# EAGLE design OneWire_I2C_8 (EAGLE 7.2.0)
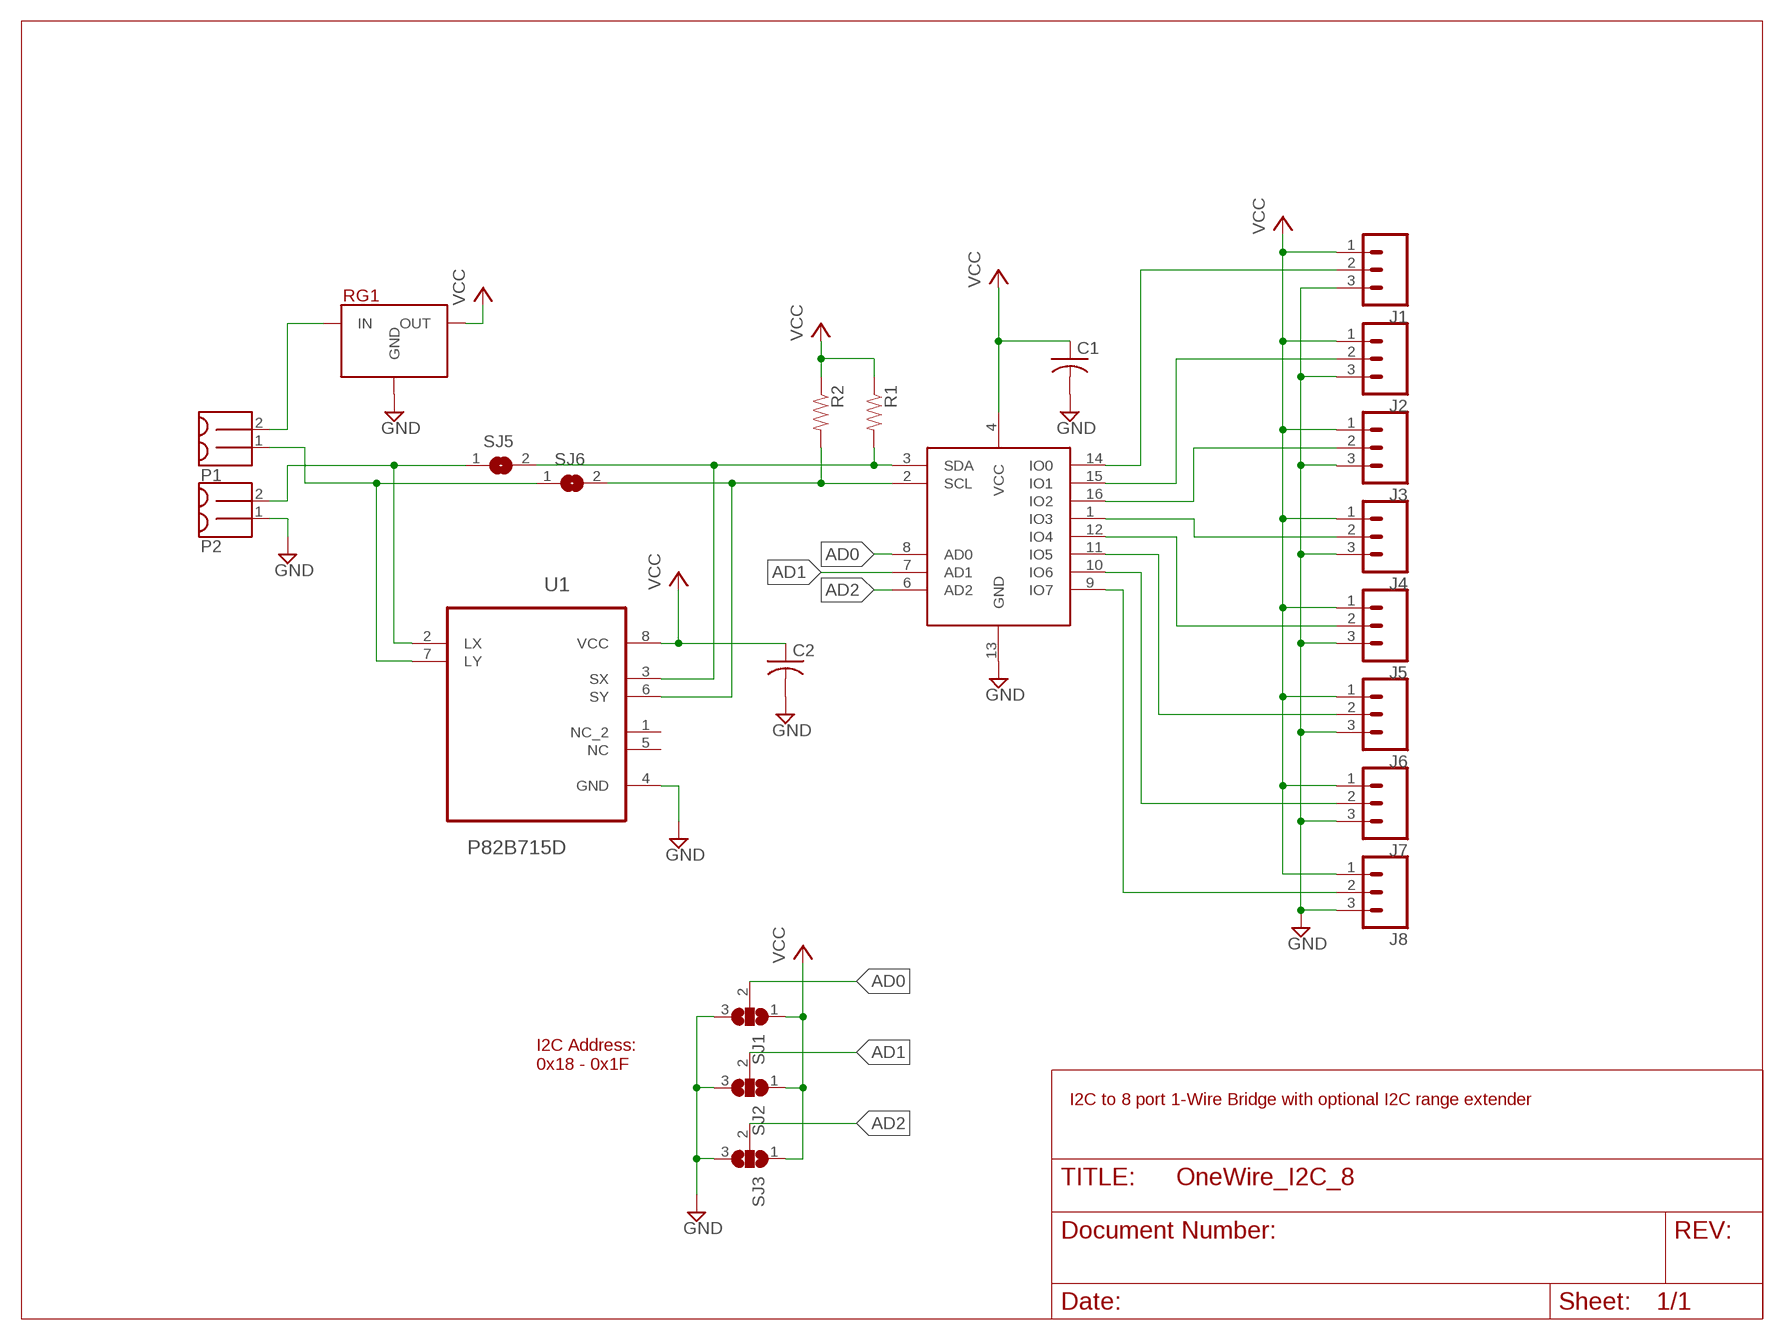
[diagram p0: schematic, sheet 1]

## Parts
C1  C-USC0603  [C0603]
C2  C-USC0603  [C0603]
J1  M03PTH  [1X03]
J2  M03PTH  [1X03]
J3  M03PTH  [1X03]
J4  M03PTH  [1X03]
J5  M03PTH  [1X03]
J6  M03PTH  [1X03]
J7  M03PTH  [1X03]
J8  M03PTH  [1X03]
P1  MOLEX_MINILITE_TRAP_2  [MOLEX_MINILITE_TRAP_2]
P2  MOLEX_MINILITE_TRAP_2  [MOLEX_MINILITE_TRAP_2]
R1  RESISTOR0603-RES  [0603-RES]
R2  RESISTOR0603-RES  [0603-RES]
RG1  MURATA_REG  [MURATA_REG_HOR]
SJ1  SJ2W  [SJ_2]
SJ2  SJ2W  [SJ_2]
SJ3  SJ2W  [SJ_2]
SJ5  SJ  [SJ]
SJ6  SJ  [SJ]
U1  P82B715D  [SOIC127P600X175-8N]
W1  DS2482-800  [SOIC16]

## Nets
AD0: SJ1.2 W1.8(AD0)
AD1: SJ2.2 W1.7(AD1)
AD2: SJ3.2 W1.6(AD2)
GND: C1.2 C2.2 J1.3 J2.3 J3.3 J4.3 J5.3 J6.3 J7.3 J8.3 P2.1 RG1.2(GND) SJ1.3 SJ2.3 SJ3.3 U1.4(GND) W1.13(GND)
IN: P1.2 RG1.1(IN)
IO0: J1.2 W1.14(IO0)
IO1: J2.2 W1.15(IO1)
IO2: J3.2 W1.16(IO2)
IO3: J4.2 W1.1(IO3)
IO4: J5.2 W1.12(IO4)
IO5: J6.2 W1.11(IO5)
IO6: J7.2 W1.10(IO6)
IO7: J8.2 W1.9(IO7)
LY: P1.1 SJ6.1 U1.7(LY)
N$3: P2.2 SJ5.1 U1.2(LX)
SCL: R2.2 SJ6.2 U1.6(SY) W1.2(SCL)
SDA: R1.2 SJ5.2 U1.3(SX) W1.3(SDA)
VCC: C1.1 C2.1 J1.1 J2.1 J3.1 J4.1 J5.1 J6.1 J7.1 J8.1 R1.1 R2.1 RG1.3(OUT) SJ1.1 SJ2.1 SJ3.1 U1.8(VCC) W1.4(VCC)
Unconnected: U1.1(NC_2) U1.5(NC)

## Notes on the sheet
- I2C Address: 
  0x18 - 0x1F
- I2C to 8 port 1-Wire Bridge with optional I2C range extender

## Library data of the parts
C1 C2 = resistor:C-US: CAPACITOR, American symbol
J1-J8 = SparkFun-Connectors:M03: Header 3 Standard 3-pin 0.1" header. Use with straight break away headers (SKU : PRT-00116), right angle break away headers (PRT-00553), swiss pins (PRT-00743), machine pins (PRT-00117), and female headers (PRT-00115). Molex polarized connector foot print use with SKU : PRT-08232 with associated crimp pins and housings.
P1 P2 = Puffin:MOLEX_MINILITE_TRAP_2
R1 R2 = SparkFun-Passives:RESISTOR: Resistor Basic schematic elements and footprints for 0603, 1206, and PTH resistors.
RG1 = Puffin:MURATA_REG
SJ1-SJ3 = jumper:SJ2W: SMD solder JUMPER
SJ5 SJ6 = jumper:SJ: SMD solder JUMPER
U1 = Texas Instruments_By_element14_Batch_1:P82B715D: I2C BUS EXTENDER; MPN: P82B715D; OC_FARNELL: 1604945; OC_NEWARK: 84M9793; PACKAGE: SOIC-8; SUPPLIER: Texas Instruments
W1 = Puffin:DS2482-800: DS2482-800 I2C-to-1-Wire® bridge device with 8 inputs

## Board
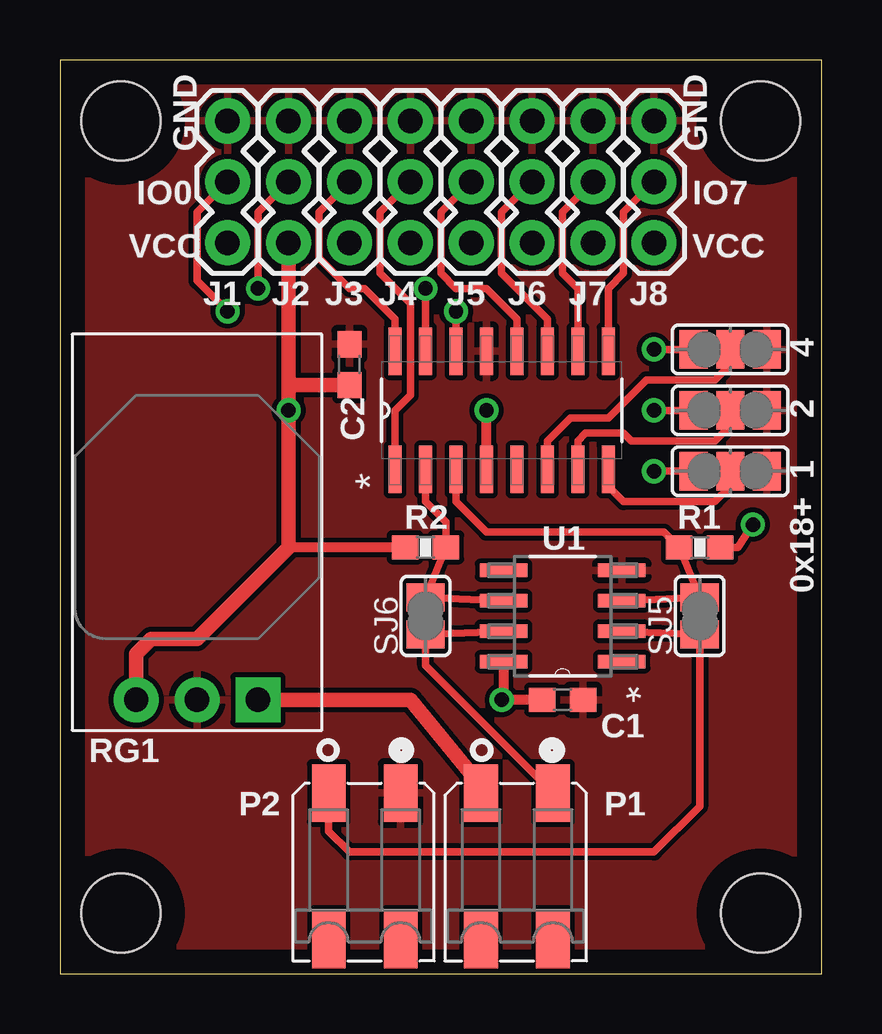
[diagram p1: board, top side]
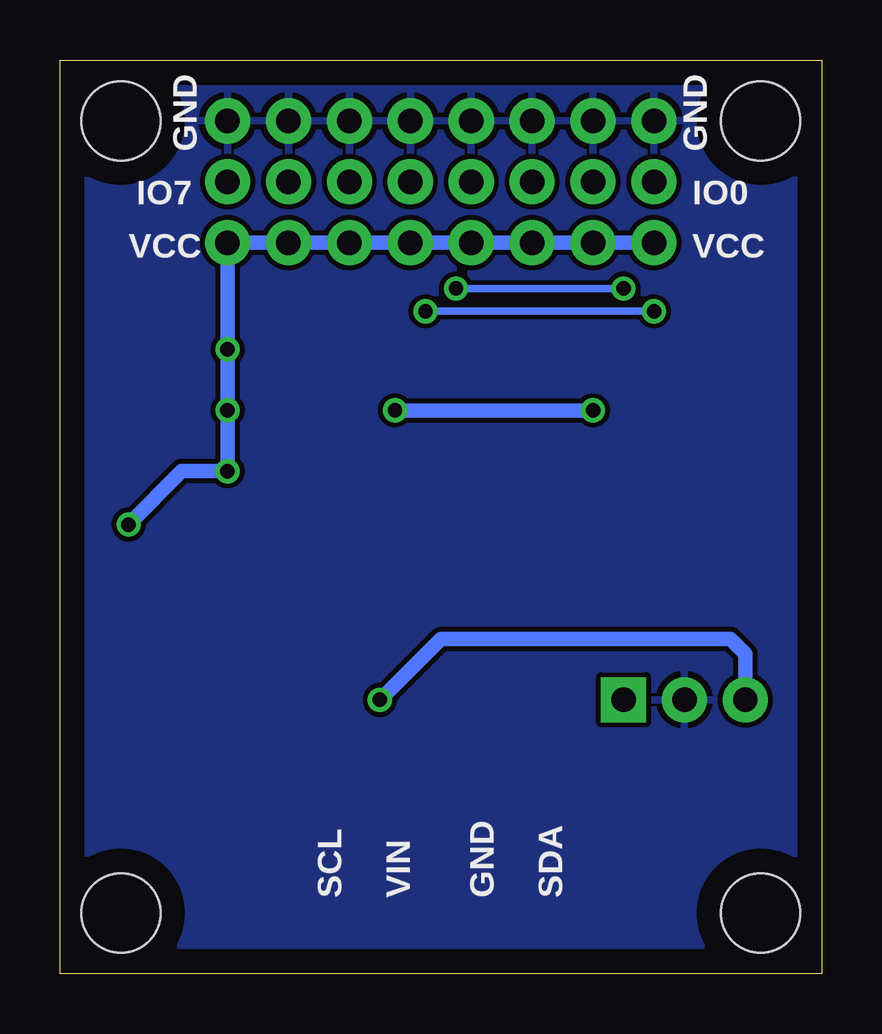
[diagram p2: board, bottom side, seen from below]

Size 31.75 x 38.1 mm. Coordinates in mm from the lower left corner, seen from the top.
Outline: 0,0 31.75,0 31.75,38.1 0,38.1 0,0
Copper layers (1*16): Top 0.035mm / dielectric 1.5mm / Bottom 0.035mm
Design rules "default": minimum track width 10mil, minimum drill 24mil, track to track 8mil, track to pad 8mil, pad to pad 8mil, via to via 8mil, smd to smd 8mil, copper to edge 40mil, drill to drill 8mil, minimum pad ring 10mil, minimum via ring 8mil, stop-mask expansion 4mil, vias tented up to drill 0mil, thermal gap 10mil

### Footprints (pad centres in the part's own frame; a part is rotated, then mirrored left to right if it is on the bottom)
C0603 = smd 1.1 x 1: 1 -0.85,0; 2 0.85,0
1X03 = drill 1.016 pad 1.88: 1 0,0; 2 2.54,0; 3 5.08,0
MOLEX_MINILITE_TRAP_2 = smd 2.4 x 1.4: 1 -3.1,1.5; 2 -3.1,-1.5; 3 3,1.5; 4 3,-1.5
0603-RES = smd 1.1 x 1: 1 -0.85,0; 2 0.85,0
MURATA_REG_HOR = drill 1.016 pad 1.88 square: 1 2.54,0 | drill 1.016 pad 1.88: 2 0,0; 3 -2.54,0
SJ_2 = smd 1.168 x 1.6: 1 -1.524,0; 2 0,0; 3 1.524,0
SJ = smd 1.168 x 1.6: 1 -0.762,0; 2 0.762,0
SOIC127P600X175-8N = smd 1.981 x 0.559: 1 -2.464,1.905; 2 -2.464,0.635; 3 -2.464,-0.635; 4 -2.464,-1.905; 5 2.464,-1.905; 6 2.464,-0.635; 7 2.464,0.635; 8 2.464,1.905
STAND-OFF = hole 3.302: 0,0
SOIC16 = smd 1.981 x 0.533: 1 -2.464,4.445; 2 -2.464,3.175; 3 -2.464,1.905; 4 -2.464,0.635; 5 -2.464,-0.635; 6 -2.464,-1.905; 7 -2.464,-3.175; 8 -2.464,-4.445; 9 2.464,-4.445; 10 2.464,-3.175; 11 2.464,-1.905; 12 2.464,-0.635; 13 2.464,0.635; 14 2.464,1.905; 15 2.464,3.175; 16 2.464,4.445

### Placement (x,y rotation side)
C1  20.95,11.43 0 top
C2  12.06,25.4 90 top
J1  6.99,30.48 90 top
J2  9.53,30.48 90 top
J3  12.06,30.48 90 top
J4  14.61,30.48 90 top
J5  17.14,30.48 90 top
J6  19.68,30.48 90 top
J7  22.23,30.48 90 top
J8  24.77,30.48 90 top
P1  19.05,4.45 270 top
P2  12.7,4.45 270 top
R1  26.67,17.78 180 top
R2  15.24,17.78 0 top
RG1  5.71,11.43 0 top
SJ1  27.94,20.95 0 top
SJ2  27.94,23.5 0 top
SJ3  27.94,26.04 0 top
SJ5  26.67,14.92 90 top
SJ6  15.24,14.92 90 top
U1  20.95,14.92 180 top
U$1  [STAND-OFF]  2.54,35.56 0 top
U$2  [STAND-OFF]  2.54,2.54 0 top
U$3  [STAND-OFF]  29.21,2.54 0 top
U$4  [STAND-OFF]  29.21,35.56 0 top
W1  18.41,23.5 90 top

### Tracks (layer width: path | path; a pad name or v marks a point on that pad's centre or on a via)
AD0
  Top 0.305: SJ1.2 27.94,20.32 27.3,19.68 23.5,19.68 22.86,20.32 W1.8
AD1
  Top 0.305: W1.7 21.59,22.23 21.91,22.54 23.5,22.54 23.81,22.23 27.3,22.23 27.94,22.86 SJ2.2
AD2
  Top 0.305: SJ3.2 27.94,25.4 27.3,24.77 24.45,24.77 22.86,23.18 21.27,23.18 20.32,22.23 W1.6
GND
  pour Bottom: -0.64,38.1 -0.64,-0.64 32.38,-0.64 32.38,38.1
  pour Top: -0.64,38.1 -0.64,-0.64 32.38,-0.64 32.38,38.1
IN
  Top 0.61: P1.2 17.55,7.85 14.61,11.43 RG1.1
IO0  (via drill 0.6)
  Top 0.305: W1.14 v16.51,27.62 | v6.99,27.62 5.71,28.89 5.71,31.75 J1.2
  Bottom 0.305: v6.99,27.62 v16.51,27.62
IO1  (via drill 0.6)
  Top 0.305: W1.15 v15.24,28.57 | v8.26,28.57 8.26,31.75 J2.2
  Bottom 0.305: v15.24,28.57 v8.26,28.57
IO2
  Top 0.305: W1.16 13.97,27.3 12.7,28.57 12.06,28.57 10.79,29.84 10.79,31.75 J3.2
IO3
  Top 0.305: W1.1 13.97,23.5 14.61,24.13 14.61,27.94 13.34,29.21 13.34,31.75 J4.2
IO4
  Top 0.305: J5.2 15.88,31.75 15.88,29.21 16.51,28.57 17.78,28.57 19.05,27.3 W1.12
IO5
  Top 0.305: J6.2 18.41,31.75 18.41,29.21 20.32,27.3 W1.11
IO6
  Top 0.305: W1.10 21.59,28.57 20.95,29.21 20.95,31.75 J7.2
IO7
  Top 0.305: J8.2 23.5,31.75 23.5,29.21 22.86,28.57 W1.9 22.86,26.67
LY
  Top 0.305: U1.7 SJ6.1 15.24,12.86 P1.1
N$3
  Top 0.305: U1.2 SJ5.1 26.67,6.99 24.77,5.08 12.06,5.08 11.2,5.95 P2.2
SCL
  Top 0.305: U1.6 SJ6.2 R2.2 16.09,18.84 15.24,19.68 W1.2
SDA
  Top 0.305: U1.3 SJ5.2 R1.2 25.18,18.41 17.78,18.41 16.51,19.68 W1.3
VCC  (via drill 0.6)
  Top 0.305: SJ3.1 v24.77,26.04 | SJ2.1 v24.77,23.5 | SJ1.1 v24.77,20.95 | R1.1 28.26,17.78 v28.89,18.73
  Top 0.406: W1.4 v17.78,23.5 | C1.1 v18.41,11.43 18.49,11.51 U1.8 | R2.1 9.53,17.78
  Top 0.61: J2.1 9.53,24.45 | 9.53,24.45 v9.53,23.5 9.53,17.78 5.71,13.97 3.81,13.97 3.17,13.34 RG1.3 | C2.1 9.63,24.55 9.53,24.45
  Bottom 0.61: J1.1 J2.1 J3.1 J4.1 J5.1 J6.1 J7.1 J8.1 v24.77,26.04 v24.77,23.5 v24.77,20.95 26.67,20.95 v28.89,18.73 | v18.41,11.43 15.88,13.97 3.81,13.97 3.17,13.34 RG1.3 | v17.78,23.5 v9.53,23.5

### Text on the board
tPlace: GND | GND | IO0 | IO7 | VCC | VCC | 4 | 2 | 1 | 0x18+
bPlace: GND | GND | IO0 | IO7 | VCC | VCC | SDA | GND | VIN | SCL
tDocu: SCL | SDA